# Altium schematic sheet uC.SchDoc
size OrCAD B; SheetNumber: 4; SheetTotal: 15
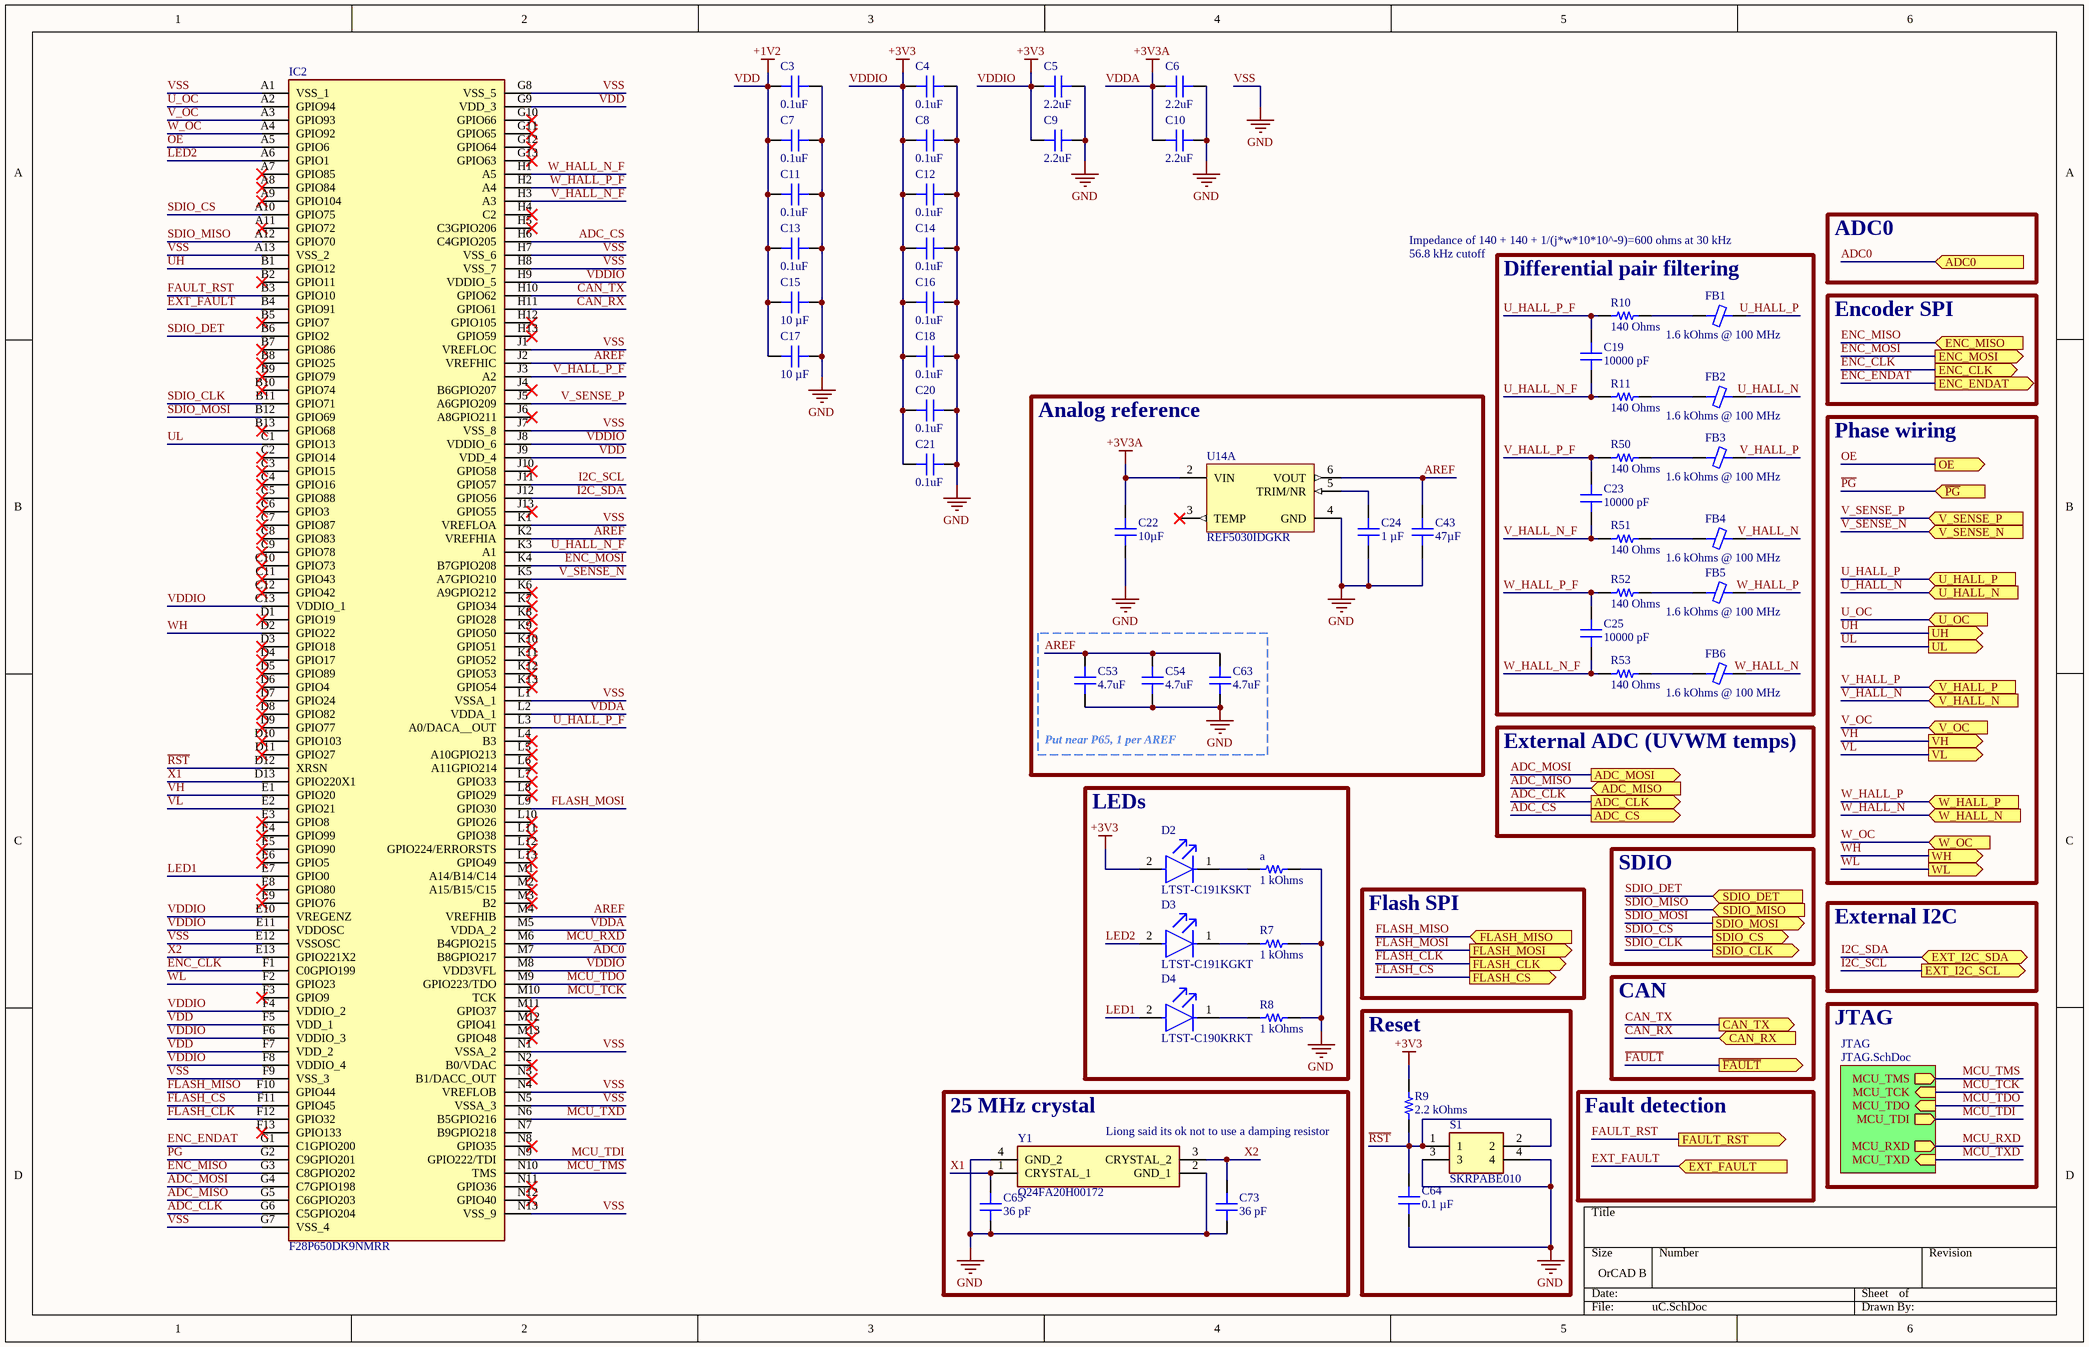
[diagram p0: uC.SchDoc]

## Parts
a  1 kOhms  [YAGEO RES 0402_1005]
C3  0.1uF  [0µF 0201-Footprint-1]
C4  0.1uF  [0µF 0201-Footprint-1]
C5  2.2uF  [0µF 0201-Footprint-1]
C6  2.2uF  [0µF 0201-Footprint-1]
C7  0.1uF  [0µF 0201-Footprint-1]
C8  0.1uF  [0µF 0201-Footprint-1]
C9  2.2uF  [0µF 0201-Footprint-1]
C10  2.2uF  [0µF 0201-Footprint-1]
C11  0.1uF  [0µF 0201-Footprint-1]
C12  0.1uF  [0µF 0201-Footprint-1]
C13  0.1uF  [0µF 0201-Footprint-1]
C14  0.1uF  [0µF 0201-Footprint-1]
C15  10 µF  [CAP 0402_1005]
C16  0.1uF  [0µF 0201-Footprint-1]
C17  10 µF  [CAP 0402_1005]
C18  0.1uF  [0µF 0201-Footprint-1]
C19  10000 pF  [CAP 0402_1005]
C20  0.1uF  [0µF 0201-Footprint-1]
C21  0.1uF  [0µF 0201-Footprint-1]
C22  10µF  [CAP 0402_1005]
C23  10000 pF  [CAP 0402_1005]
C24  1 µF  [CAP 0402_1005]
C25  10000 pF  [CAP 0402_1005]
C43  47µF  [CAP 0603_1608]
C53  4.7uF  [0µF 0201-Footprint-1]
C54  4.7uF  [0µF 0201-Footprint-1]
C63  4.7uF  [0µF 0201-Footprint-1]
C64  0.1 µF  [CAP 0402_1005]
C65  36 pF  [CAP 0402_1005]
C73  36 pF  [CAP 0402_1005]
D2  LTST-C191KSKT  [FP-LTST-C191KSKT-MFG]
D3  LTST-C191KGKT  [FP-LTST-C191KGKT-MFG]
D4  LTST-C190KRKT  [FP-LTST-C190KRKT-MFG]
FB1  1.6 kOhms @ 100 MHz  [FER 0603_1608]
FB2  1.6 kOhms @ 100 MHz  [FER 0603_1608]
FB3  1.6 kOhms @ 100 MHz  [FER 0603_1608]
FB4  1.6 kOhms @ 100 MHz  [FER 0603_1608]
FB5  1.6 kOhms @ 100 MHz  [FER 0603_1608]
FB6  1.6 kOhms @ 100 MHz  [FER 0603_1608]
IC2  F28P650DK9NMRR  [BGA169C65P13X13_900X900X100]
R7  1 kOhms  [YAGEO RES 0402_1005]
R8  1 kOhms  [YAGEO RES 0402_1005]
R9  2.2 kOhms  [RES 0402_1005]
R10  140 Ohms  [RES 0402_1005]
R11  140 Ohms  [RES 0402_1005]
R50  140 Ohms  [RES 0402_1005]
R51  140 Ohms  [RES 0402_1005]
R52  140 Ohms  [RES 0402_1005]
R53  140 Ohms  [RES 0402_1005]
S1  SKRPABE010  [SKRPABE010]
U14  REF5030IDGKR  [DGK0008A_L]  (part A of 2)
Y1  Q24FA20H00172  [FA20H160000MF12ZAC3]

## Blocks framed on the sheet
Differential pair filtering: C19 C23 C25 FB1-FB6 R10 R11 R50-R53
Analog reference: C22 C24 C43 U14
Put near P65, 1 per AREF: C53 C54 C63
LEDs: a D2-D4 R7 R8
Reset: C64 R9 S1
25 MHz crystal: C65 C73 Y1

## Sub-sheets
JTAG = JTAG.SchDoc: MCU_TMS (out), MCU_TCK (in), MCU_TDO (in), MCU_TDI (out), MCU_RXD (out), MCU_TXD (in)

## Ports
ADC0 (in), ADC_CLK (out), ADC_CS (out), ADC_MISO (in), ADC_MOSI (out), CAN_RX (in), CAN_TX (out), ENC_CLK (out), ENC_ENDAT (out), ENC_MISO (in), ENC_MOSI (out), EXT_FAULT (in), EXT_I2C_SCL (out), EXT_I2C_SDA (bidir), FAULT_RST (out), FLASH_CLK (out), FLASH_CS (out), FLASH_MISO (in), FLASH_MOSI (out), OE (out), SDIO_CLK (out), SDIO_CS (out), SDIO_DET (in), SDIO_MISO (in), SDIO_MOSI (out), U_HALL_N (in), U_HALL_P (in), U_OC (in), UH (out), UL (out), V_HALL_N (in), V_HALL_P (in), V_OC (in), V_SENSE_N (in), V_SENSE_P (in), VH (out), VL (out), W_HALL_N (in), W_HALL_P (in), W_OC (in), WH (out), WL (out), ~{FAULT} (out), ~{PG} (in)

## Nets
VDD: C3.1 C7.1 C11.1 C13.1 C15.1 C17.1 IC2.F5(VDD_1) IC2.F7(VDD_2) IC2.G9(VDD_3) IC2.J9(VDD_4)  [also labelled +1V2]
VDDA: C6.1 C10.1 C22.2 IC2.L2(VDDA_1) IC2.M5(VDDA_2) U14.2(VIN)  [also labelled +3V3A]
VDDIO: C4.1 C5.1 C8.1 C9.1 C12.1 C14.1 C16.1 C18.1 C20.1 C21.1 D2.2(A) IC2.C13(VDDIO_1) IC2.E10(VREGENZ) IC2.E11(VDDOSC) IC2.F4(VDDIO_2) IC2.F6(VDDIO_3) IC2.F8(VDDIO_4) IC2.H9(VDDIO_5) IC2.J8(VDDIO_6) IC2.M8(VDD3VFL) R9.2  [also labelled +3V3]
VSS: a.2 C3.2 C4.2 C5.2 C6.2 C7.2 C8.2 C9.2 C10.2 C11.2 C12.2 C13.2 C14.2 C15.2 C16.2 C17.2 C18.2 C20.2 C21.2 C22.1 C24.1 C43.1 C53.1 C54.1 C63.1 C64.1 C65.1 C73.1 IC2.A1(VSS_1) IC2.A13(VSS_2) IC2.E12(VSSOSC) IC2.F9(VSS_3) IC2.G7(VSS_4) IC2.G8(VSS_5) IC2.H7(VSS_6) IC2.H8(VSS_7) IC2.J1(VREFLOC) IC2.J7(VSS_8) IC2.K1(VREFLOA) IC2.L1(VSSA_1) IC2.N1(VSSA_2) IC2.N4(VREFLOB) IC2.N5(VSSA_3) IC2.N13(VSS_9) R7.2 R8.2 S1.3 S1.4 U14.4(GND) Y1.2(GND_1) Y1.4(GND_2)  [also labelled GND]
ADC0: IC2.M7(B8GPIO217) ; port ADC0
ADC_CLK: IC2.G6(C5GPIO204) ; port ADC_CLK
ADC_CS: IC2.H6(C4GPIO205) ; port ADC_CS
ADC_MISO: IC2.G5(C6GPIO203) ; port ADC_MISO
ADC_MOSI: IC2.G4(C7GPIO198) ; port ADC_MOSI
AREF: C43.2 C53.2 C54.2 C63.2 IC2.J2(VREFHIC) IC2.K2(VREFHIA) IC2.M4(VREFHIB) U14.6(VOUT)
CAN_RX: IC2.H11(GPIO61) ; port CAN_RX
CAN_TX: IC2.H10(GPIO62) ; port CAN_TX
ENC_CLK: IC2.F1(C0GPIO199) ; port ENC_CLK
ENC_ENDAT: IC2.G1(C1GPIO200) ; port ENC_ENDAT
ENC_MISO: IC2.G3(C8GPIO202) ; port ENC_MISO
ENC_MOSI: IC2.K4(B7GPIO208) ; port ENC_MOSI
EXT_FAULT: IC2.B4(GPIO91) ; port EXT_FAULT
~{FAULT}: port ~{FAULT}
FAULT_RST: IC2.B3(GPIO10) ; port FAULT_RST
FLASH_CLK: IC2.F12(GPIO32) ; port FLASH_CLK
FLASH_CS: IC2.F11(GPIO45) ; port FLASH_CS
FLASH_MISO: IC2.F10(GPIO44) ; port FLASH_MISO
FLASH_MOSI: IC2.L9(GPIO30) ; port FLASH_MOSI
I2C_SCL: IC2.J11(GPIO57) ; port EXT_I2C_SCL
I2C_SDA: IC2.J12(GPIO56) ; port EXT_I2C_SDA
LED1: D4.2(A) IC2.E7(GPIO0)
LED2: D3.2(A) IC2.A6(GPIO1)
MCU_RXD: IC2.M6(B4GPIO215) ; sheet JTAG/MCU_RXD
MCU_TCK: IC2.M10(TCK) ; sheet JTAG/MCU_TCK
MCU_TDI: IC2.N9(GPIO222/TDI) ; sheet JTAG/MCU_TDI
MCU_TDO: IC2.M9(GPIO223/TDO) ; sheet JTAG/MCU_TDO
MCU_TMS: IC2.N10(TMS) ; sheet JTAG/MCU_TMS
MCU_TXD: IC2.N6(B5GPIO216) ; sheet JTAG/MCU_TXD
OE: IC2.A5(GPIO6) ; port OE
~{PG}: IC2.G2(C9GPIO201) ; port ~{PG}
~{RST}: C64.2 IC2.D12(XRSN) R9.1 S1.1 S1.2
SDIO_CLK: IC2.B11(GPIO71) ; port SDIO_CLK
SDIO_CS: IC2.A10(GPIO75) ; port SDIO_CS
SDIO_DET: IC2.B6(GPIO2) ; port SDIO_DET
SDIO_MISO: IC2.A12(GPIO70) ; port SDIO_MISO
SDIO_MOSI: IC2.B12(GPIO69) ; port SDIO_MOSI
U_HALL_N: FB2.2 ; port U_HALL_N
U_HALL_N_F: C19.1 IC2.K3(A1) R11.1
U_HALL_P: FB1.2 ; port U_HALL_P
U_HALL_P_F: C19.2 IC2.L3(A0/DACA__OUT) R10.1
U_OC: IC2.A2(GPIO94) ; port U_OC
UH: IC2.B1(GPIO12) ; port UH
UL: IC2.C1(GPIO13) ; port UL
V_HALL_N: FB4.2 ; port V_HALL_N
V_HALL_N_F: C23.1 IC2.H3(A3) R51.1
V_HALL_P: FB3.2 ; port V_HALL_P
V_HALL_P_F: C23.2 IC2.J3(A2) R50.1
V_OC: IC2.A3(GPIO93) ; port V_OC
V_SENSE_N: IC2.K5(A7GPIO210) ; port V_SENSE_N
V_SENSE_P: IC2.J5(A6GPIO209) ; port V_SENSE_P
VH: IC2.E1(GPIO20) ; port VH
VL: IC2.E2(GPIO21) ; port VL
W_HALL_N: FB6.2 ; port W_HALL_N
W_HALL_N_F: C25.1 IC2.H1(A5) R53.1
W_HALL_P: FB5.2 ; port W_HALL_P
W_HALL_P_F: C25.2 IC2.H2(A4) R52.1
W_OC: IC2.A4(GPIO92) ; port W_OC
WH: IC2.D2(GPIO22) ; port WH
WL: IC2.F2(GPIO23) ; port WL
X1: C65.2 IC2.D13(GPIO220X1) Y1.1(CRYSTAL_1)
X2: C73.2 IC2.E13(GPIO221X2) Y1.3(CRYSTAL_2)
Neta_1: a.1 D2.1(C)
NetC24_2: C24.2 U14.5(TRIM/NR)
NetD3_1: D3.1(C) R7.1
NetD4_1: D4.1(C) R8.1
NetFB1_1: FB1.1 R10.2
NetFB2_1: FB2.1 R11.2
NetFB3_1: FB3.1 R50.2
NetFB4_1: FB4.1 R51.2
NetFB5_1: FB5.1 R52.2
NetFB6_1: FB6.1 R53.2

Not connected (* = marked no-connect by the designer): IC2 A7(GPIO85)* A8(GPIO84)* A9(GPIO104)* A11(GPIO72)* B2(GPIO11)* B5(GPIO7)* B7(GPIO86)* B8(GPIO25)* B9(GPIO79)* B10(GPIO74)* B13(GPIO68)* C2(GPIO14)* C3(GPIO15)* C4(GPIO16)* C5(GPIO88)* C6(GPIO3)* C7(GPIO87)* C8(GPIO83)* C9(GPIO78)* C10(GPIO73)* C11(GPIO43)* C12(GPIO42)* D1(GPIO19)* D3(GPIO18)* D4(GPIO17)* D5(GPIO89)* D6(GPIO4)* D7(GPIO24)* D8(GPIO82)* D9(GPIO77)* D10(GPIO103)* D11(GPIO27)* E3(GPIO8)* E4(GPIO99)* E5(GPIO90)* E6(GPIO5)* E8(GPIO80)* E9(GPIO76)* F3(GPIO9)* F13(GPIO133)* G10(GPIO66)* G11(GPIO65)* G12(GPIO64)* G13(GPIO63)* H4(C2)* H5(C3GPIO206)* H12(GPIO105)* H13(GPIO59)* J4(B6GPIO207)* J6(A8GPIO211)* J10(GPIO58)* J13(GPIO55)* K6(A9GPIO212)* K7(GPIO34)* K8(GPIO28)* K9(GPIO50)* K10(GPIO51)* K11(GPIO52)* K12(GPIO53)* K13(GPIO54)* L4(B3)* L5(A10GPIO213)* L6(A11GPIO214)* L7(GPIO33)* L8(GPIO29)* L10(GPIO26)* L11(GPIO38)* L12(GPIO224/ERRORSTS)* L13(GPIO49)* M1(A14/B14/C14)* M2(A15/B15/C15)* M3(B2)* M11(GPIO37)* M12(GPIO41)* M13(GPIO48)* N2(B0/VDAC)* N3(B1/DACC_OUT)* N7(B9GPIO218) N8(GPIO35)* N11(GPIO36)* N12(GPIO40)*; U14 3(TEMP)*

## Notes on the sheet
- 56.8 kHz cutoff
- Impedance of 140 + 140 + 1/(j*w*10*10^-9)=600 ohms at 30 kHz
- ADC0
- Encoder SPI
- Phase wiring
- External ADC (UVWM temps)
- SDIO
- Flash SPI
- External I2C
- CAN
- JTAG
- Liong said its ok not to use a damping resistor
- Fault detection

## Library data of the parts
a R7 R8 = RC0402JR-071KL: RES 1K OHM 5% 1/16W 0402; Manufacturer: Yageo; Power (Watts): 0.063W, 1/16W; Temperature Coefficient: ±100ppm/°C; Part Number: RC0402JR-071KL; Value: 1 kOhms; ComponentLink1Description: Datasheet; ComponentLink1URL: https://www.yageo.com/upload/media/product/productsearch/datasheet/rchip/PYu-RC_Group_51_RoHS_L_10.pdf; ComponentLink2Description: DigiKey Link; ComponentLink2URL: https://www.digikey.com/en/products/detail/yageo/RC0402JR-071KL/726408; Composition: Thick Film; Device Package: 0402 (1005 Metric); Features: Moisture Resistant; Height - Seated (Max): 0.016" (0.40mm); LastUpdated: 8/31/2025 3:03:59 PM; Lifecycle Status: Active; Minimum Order: 1; Number of Terminations: 2; Operating Temperature: -55°C ~ 155°C; Package / Case: 0402 (1005 Metric); Packaging: CutTape; PartId: 20532; Part Status: Active; Price: 0.01; Resistance: 1 kOhms; Series: RC_L; Size / Dimension: 0.039" L x 0.020" W (1.00mm x 0.50mm); Supplier 1: DigiKey; Supplier Part Number 1: 311-1.0KJRCT-ND; Supplier Device Package: 0402; Tolerance: ±5%
C3 C4 C7 C8 C11-C14 C16 C18 C20 C21 = CMP-714-000035-1: CAP CER 0.1UF 16V X5R 0201; ComponentLink2Description: DigiKey Link; ComponentLink1Description: Datasheet
C5 C6 C9 C10 = CMP-714-000035-1: CAP CER 2.2UF; ComponentLink2Description: DigiKey Link; ComponentLink1Description: Datasheet
C15 C17 = CL05A106MP8NUB8: CAP CER 10UF 10V X5R 0402; manufacturer: Samsung Electro-Mechanics; Tolerance: ±20%; Part Number: CL05A106MP8NUB8; Capacitance: 10 µF; Applications: Acoustic Noise Reduction; componentlink1description: Datasheet; componentlink1url: http://www.samsungsem.com/kr/support/product-search/mlcc/CL05A106MP8NUB8.jsp; componentlink2description: DigiKey Link; componentlink2url: https://www.digikey.com/en/products/detail/samsung-electro-mechanics/CL05A106MP8NUB8/5961314; Device Package: 0402 (1005 Metric); lastupdated: 2/9/2024 8:04:38 PM; Lifecycle Status: Active; Minimum Order: 1; Mounting Type: Surface Mount, MLCC; Operating Temperature: -55°C ~ 85°C; Package / Case: 0402 (1005 Metric); packaging: TapeAndReel; partid: 1758; Part Status: Active; price: 0.06; series: CL; Size / Dimension: 0.039" L x 0.020" W (1.00mm x 0.50mm); Supplier 1: DigiKey; Supplier Part Number 1: 1276-6830-1-ND; Temperature Coefficient: X5R; Thickness (Max): 0.035" (0.90mm); value: 10 µF; Voltage - Rated: 10V
C19 C23 C25 = C0402C103J5RECAUTO: CAP CER 0402 10NF 50V X7R 5%; manufacturer: KEMET; Part Number: C0402C103J5RECAUTO; Capacitance: 10000 pF; Applications: Automotive, ESD Protection; componentlink1description: Datasheet; componentlink1url: https://api.kemet.com/component-edge/download/datasheet/C0402C103J5RECAUTO.pdf; componentlink2description: DigiKey Link; componentlink2url: https://www.digikey.com/en/products/detail/kemet/C0402C103J5RECAUTO/8646448; Device Package: 0402 (1005 Metric); lastupdated: 2/9/2024 8:04:13 PM; Lifecycle Status: Active; Minimum Order: 1; Mounting Type: Surface Mount, MLCC; Operating Temperature: -55°C ~ 125°C; Package / Case: 0402 (1005 Metric); packaging: TapeAndReel; partid: 33153; Part Status: Active; price: 0.02; Ratings: AEC-Q200; series: ESD SMD Auto X7R; Size / Dimension: 0.039" L x 0.020" W (1.00mm x 0.50mm); Supplier 1: DigiKey; Supplier Part Number 1: 399-C0402C103J5RECAUTOCT-ND; Temperature Coefficient: X7R; Thickness (Max): 0.022" (0.55mm); Tolerance: ±5%; value: 10000 pF; Voltage - Rated: 50V
C22 = 0402ZD106MAT2A: CAP CER 10UF 10V X5R 0402; manufacturer: AVX Corporation; Tolerance: ±20%; Part Number: 0402ZD106MAT2A; Capacitance: 10µF; Applications: General Purpose; componentlink1description: Datasheet; componentlink1url: http://datasheets.avx.com/cx5r.pdf; componentlink2description: DigiKey Link; componentlink2url: http://digikey.com/product-detail/en/avx-corporation/0402ZD106MAT2A/478-10052-1-ND/6564275; Device Package: 0402 (1005 Metric); lastupdated: 2/8/2022 12:26:50 PM; Lifecycle Status: Active; Minimum Order: 1; Mounting Type: Surface Mount, MLCC; Operating Temperature: -55°C ~ 85°C; Package / Case: 0402 (1005 Metric); packaging: TapeAndReel; partid: 6854; Part Status: Active; price: 0.24; series: -; Size / Dimension: 0.039" L x 0.020" W (1.00mm x 0.50mm); Supplier 1: DigiKey; Supplier Part Number 1: 478-10052-1-ND; Temperature Coefficient: X5R; Thickness (Max): 0.028" (0.71mm); value: 10µF; Voltage - Rated: 10V
C24 = 0402BW105K160NGT: CAP CER 1UF 16V X5R 0402; manufacturer: Knowles Novacap; Tolerance: ±10%; Part Number: 0402BW105K160NGT; Capacitance: 1 µF; Applications: General Purpose; componentlink1description: Datasheet; componentlink1url: https://www.knowlescapacitors.com/getattachment/6c8d48ef-fc2b-4752-ae2c-ce6c208de0c4/High-Capacitance-Chip.aspx; componentlink2description: DigiKey Link; componentlink2url: https://www.digikey.com/en/products/detail/knowles-novacap/0402BW105K160NGT/7304075; Device Package: 0402 (1005 Metric); Features: Gold Flash Termination; lastupdated: 2/9/2024 8:04:33 PM; Lifecycle Status: Active; Minimum Order: 1; Mounting Type: Surface Mount, MLCC; Operating Temperature: -55°C ~ 85°C; Package / Case: 0402 (1005 Metric); packaging: TapeAndReel; partid: 4314; Part Status: Active; price: 1.00; series: -; Size / Dimension: 0.040" L x 0.020" W (1.02mm x 0.51mm); Supplier 1: DigiKey; Supplier Part Number 1: 1763-1163-1-ND; Temperature Coefficient: X5R; Thickness (Max): 0.024" (0.61mm); value: 1 µF; Voltage - Rated: 16V
C43 = 06036D476MAT2A: CAP CER 47UF 6.3V X5R 0603; manufacturer: AVX Corporation; Tolerance: ±20%; Part Number: 06036D476MAT2A; Capacitance: 47µF; Applications: General Purpose; componentlink1description: Datasheet; componentlink1url: http://datasheets.avx.com/cx5r.pdf; componentlink2description: DigiKey Link; componentlink2url: http://digikey.com/product-detail/en/avx-corporation/06036D476MAT2A/478-11180-1-ND/7563130; Device Package: 0603 (1608 Metric); lastupdated: 9/2/2020 1:03:20 AM; Lifecycle Status: Active; Minimum Order: 1; Mounting Type: Surface Mount, MLCC; Operating Temperature: -55°C ~ 85°C; Package / Case: 0603 (1608 Metric); packaging: TapeAndReel; partid: 11014; Part Status: Active; price: 0.41; series: -; Size / Dimension: 0.063" L x 0.031" W (1.60mm x 0.80mm); Supplier 1: DigiKey; Supplier Part Number 1: 478-11180-1-ND; Temperature Coefficient: X5R; value: 47µF; Voltage - Rated: 6.3V
C53 C54 C63 = CMP-714-000035-1: CAP CER 4.7UF; ComponentLink2Description: DigiKey Link; ComponentLink1Description: Datasheet
C64 = 0402B104J160CT: CAP CER 0.1UF 16V X7R 0402; manufacturer: Walsin Technology Corporation; Tolerance: ±5%; Part Number: 0402B104J160CT; Capacitance: 0.1 µF; Applications: General Purpose; componentlink1description: Datasheet; componentlink1url: http://www.passivecomponent.com/wp-content/uploads/2018/10/MLCC.pdf; componentlink2description: DigiKey Link; componentlink2url: https://www.digikey.com/en/products/detail/walsin-technology-corporation/0402B104J160CT/9354672; Device Package: 0402 (1005 Metric); lastupdated: 2/9/2024 8:04:31 PM; Lifecycle Status: Active; Minimum Order: 1; Mounting Type: Surface Mount, MLCC; Operating Temperature: -55°C ~ 125°C; Package / Case: 0402 (1005 Metric); packaging: TapeAndReel; partid: 41146; Part Status: Active; price: 0.01; series: -; Size / Dimension: 0.039" L x 0.020" W (1.00mm x 0.50mm); Supplier 1: DigiKey; Supplier Part Number 1: 1292-1174-1-ND; Temperature Coefficient: X7R; Thickness (Max): 0.022" (0.55mm); value: 0.1 µF; Voltage - Rated: 16V
C65 C73 = 0402N360J500CT: CAP CER 36PF 50V C0G/NP0 0402; manufacturer: Walsin Technology Corporation; Temperature Coefficient: C0G, NP0; Tolerance: ±5%; Part Number: 0402N360J500CT; Capacitance: 36 pF; Applications: General Purpose; componentlink1description: Datasheet; componentlink1url: http://www.passivecomponent.com/wp-content/uploads/2018/10/MLCC.pdf; componentlink2description: DigiKey Link; componentlink2url: https://www.digikey.com/en/products/detail/walsin-technology-corporation/0402N360J500CT/9354806; Device Package: 0402 (1005 Metric); lastupdated: 2/9/2024 8:04:27 PM; Lifecycle Status: Active; Minimum Order: 1; Mounting Type: Surface Mount, MLCC; Operating Temperature: -55°C ~ 125°C; Package / Case: 0402 (1005 Metric); packaging: TapeAndReel; partid: 8193; Part Status: Active; price: 0.01; series: -; Size / Dimension: 0.039" L x 0.020" W (1.00mm x 0.50mm); Supplier 1: DigiKey; Supplier Part Number 1: 1292-1309-1-ND; Thickness (Max): 0.022" (0.55mm); value: 36 pF; Voltage - Rated: 50V
D2 = CMP-22017-000025-1: LED YELLOW CLEAR SMD; Dominant Wavelength: 597nm; Power Rating: 75mW; Number of LEDs: 1; Lens Style: Diffused; Forward Current: 30mA; Test Current: 20mA; Forward Voltage: 2.4V; Wavelength: 588nm; Viewing Angle: 130°; Lens Color: Colorless; Reverse Voltage: 5V; Luminous Intensity: 180mcd; Case Code (Imperial): 0603; Width: 0.8mm; Power Dissipation: 75mW; Length: 1.6mm; Illumination Color: Yellow; Number of Pins: 2; Case Code (Metric): 1608; Mount: Surface Mount; Number of Elements: 1; Height: 0.55mm; Lens Transparency: Clear; Depth: 0.8mm; Min Operating Temperature: -55°C; Case/Package: 0603; Radiation Hardening: No; Max Operating Temperature: 85°C; Package Quantity: 1; Packaging: Tape and Reel; Lead Free: Lead Free; Color: Yellow
D3 = CMP-2000-05198-4: NexarPartId: 549907; Forward Voltage: 2V; Viewing Angle: 130°; Lens Transparency: Clear; Power Rating: 75mW; Number of LEDs: 1; Luminous Intensity: 35mcd; Forward Current: 20mA; Dominant Wavelength: 571nm; Illumination Color: Green; Lens Color: Clear, Colorless; Reverse Voltage: 5V; Wavelength: 574nm; Number of Pins: 2; Packaging: Tape and Reel; Number of Elements: 1; Schedule B: 8541402000, 8541402000; Height: 550µm; Case/Package: 0603; Depth: 800µm; Max Operating Temperature: 85°C; RoHS: Compliant; Lens Style: Clear; Lead Free: Lead Free; Length: 1.6mm; Mount: Surface Mount; Test Current: 20mA; Width: 800µm; Case Code (Imperial): 0603; Min Operating Temperature: -55°C; Case Code (Metric): 1608; Radiation Hardening: No; Power Dissipation: 75mW; Color: Green
D4 = CMP-1674-00011-2: LED RED CLEAR CHIP SMD; Reverse Voltage: 5V; Viewing Angle: 130°; Power Rating: 75mW; Test Current: 20mA; Number of Elements: 1; Lens Color: Colorless; Wavelength: 639nm; Dominant Wavelength: 631nm; Lens Style: Diffused; Forward Current: 30mA; Forward Voltage: 2.4V; Luminous Intensity: 54mcd; Color: Red; Case Code (Imperial): 0603; Lens Transparency: Clear; Lead Free: Lead Free; Package Quantity: 1; Packaging: Tape and Reel; Max Operating Temperature: 85°C; Number of Pins: 2; Height: 0.8mm; Case/Package: 0603; Number of LEDs: 1; Width: 0.8mm; Case Code (Metric): 1608; Depth: 0.8mm; Mount: Surface Mount; Radiation Hardening: No; Length: 1.6mm; Illumination Color: Red; Power Dissipation: 75mW; Min Operating Temperature: -55°C
FB1-FB6 = MHF1608BAC352ATD25: FERRITE BEAD 1.6K OHM 0603 1LN; Manufacturer: TDK Corporation; Current Rating (Max): 170mA; DC Resistance (DCR) (Max): 1.8Ohm; Number of Lines: 1; Part Number: MHF1608BAC352ATD25; ComponentLink1Description: Datasheet; ComponentLink1URL: https://media.digikey.com/pdf/Data%20Sheets/TDK%20PDFs/MHF1608_Type_DS.pdf; ComponentLink2Description: DigiKey Link; ComponentLink2URL: https://www.digikey.com/en/products/detail/tdk-corporation/MHF1608BAC352ATD25/12702586; Device Package: 0603 (1608 Metric); Height (Max): 0.037" (0.95mm); Impedance @ Frequency: 1.6 kOhms @ 100 MHz; LastUpdated: 6/3/2024 7:51:46 PM; Lifecycle Status: Active; Minimum Order: 1; Mounting Type: Surface Mount; Operating Temperature: -55°C ~ 125°C; Package / Case: 0603 (1608 Metric); Packaging: TapeAndReel; PartId: 2238; Part Status: Active; Price: 0.05; Ratings: AEC-Q200; Series: MHF; Size / Dimension: 0.063" L x 0.031" W (1.60mm x 0.80mm); Supplier 1: DigiKey; Supplier Part Number 1: 445-MHF1608BAC352ATD25CT-ND; Value: 1.6 kOhms @ 100 MHz
IC2 = F28P650DK9NMRR: Integrated Circuit; Manufacturer_Name: Texas Instruments; Datasheet Link: https://www.ti.com/lit/ds/symlink/tms320f28p650dk.pdf?ts=1743172224818&ref_url=https%253A%252F%252Fwww.ti.com%252Fproduct%252FTMS320F28P650DK%252Fpart-details%252FXF28P650DK9PTP; Height: 1mm; Manufacturer_Part_Number: F28P650DK9NMRR; Mouser Part Number: 595-F28P650DK9NMRR; Mouser Price/Stock: https://www.mouser.co.uk/ProductDetail/Texas-Instruments/F28P650DK9NMRR?qs=ZcfC38r4PouP1IzeuqZ7kg%3D%3D; Arrow Part Number: F28P650DK9NMRR; Arrow Price/Stock: https://www.arrow.com/en/products/f28p650dk9nmrr/texas-instruments?utm_currency=USD&region=nac
R9 = RR0510P-222-D: RES SMD 2.2K OHM 0.5% 1/16W 0402; Manufacturer: Susumu; Power (Watts): 0.063W, 1/16W; Temperature Coefficient: ±25ppm/°C; Part Number: RR0510P-222-D; Value: 2.2 kOhms; ComponentLink1Description: Datasheet; ComponentLink1URL: http://www.susumu.co.jp/common/pdf/n_catalog_partition05_en.pdf; ComponentLink2Description: DigiKey Link; ComponentLink2URL: https://www.digikey.com/en/products/detail/susumu/RR0510P-222-D/432405; Composition: Thin Film; Device Package: 0402 (1005 Metric); Height - Seated (Max): 0.016" (0.40mm); LastUpdated: 2/9/2024 8:30:21 PM; Lifecycle Status: Active; Minimum Order: 1; Number of Terminations: 2; Operating Temperature: -55°C ~ 125°C; Package / Case: 0402 (1005 Metric); Packaging: TapeAndReel; PartId: 3229; Part Status: Active; Price: 0.01; Resistance: 2.2 kOhms; Series: RR; Size / Dimension: 0.039" L x 0.020" W (1.00mm x 0.50mm); Supplier 1: DigiKey; Supplier Part Number 1: RR05P2.2KDCT-ND; Tolerance: ±0.5%
R10 R11 R50-R53 = RQ73C1E140RBTD: RES 140 OHMS 0.1% 1/16W 0402; Manufacturer: TE Connectivity Passive Product; Power (Watts): 0.063W, 1/16W; Temperature Coefficient: ±10ppm/°C; Part Number: RQ73C1E140RBTD; Value: 140 Ohms; ComponentLink1Description: Datasheet; ComponentLink1URL: //media.digikey.com/pdf/Data%20Sheets/Tyco%20Electronics%20P%20B%20PDFs/RQ73-0618%20v2.pdf; ComponentLink2Description: DigiKey Link; ComponentLink2URL: https://www.digikey.com/en/products/detail/te-connectivity-passive-product/RQ73C1E140RBTD/9480200; Composition: Thin Film; Device Package: 0402 (1005 Metric); Features: Anti-Sulfur, Automotive AEC-Q200; Height - Seated (Max): 0.016" (0.40mm); LastUpdated: 2/9/2024 8:30:21 PM; Lifecycle Status: Active; Minimum Order: 1; Number of Terminations: 2; Operating Temperature: -55°C ~ 155°C; Package / Case: 0402 (1005 Metric); Packaging: TapeAndReel; PartId: 3032; Part Status: Active; Price: 0.27; Ratings: AEC-Q200; Resistance: 140 Ohms; Series: RQ73; Size / Dimension: 0.039" L x 0.020" W (1.00mm x 0.50mm); Supplier 1: DigiKey; Supplier Part Number 1: A140252CT-ND; Supplier Device Package: 0402; Tolerance: ±0.1%
S1 = SKRPABE010: Switch; Manufacturer_Name: ALPS Electric; Datasheet Link: https://tech.alpsalpine.com/e/products/detail/SKRPABE010/; Height: 2.5mm; Manufacturer_Part_Number: SKRPABE010; Mouser Part Number: 688-SKRPAB; Mouser Price/Stock: https://www.mouser.co.uk/ProductDetail/Alps-Alpine/SKRPABE010?qs=m0BA540hBPe1GpcSf%2FZ5Yw%3D%3D
U14 = CMP-0367-00265-2: Low Noise, Very Low Drift, Precision Voltage Reference, -40 to 125 degC, 8-pin MSOP (DGK), Green (RoHS & no Sb/Br); Manufacturer: Texas Instruments; VI(Min)(V): 3.2; SubFamily: Series Voltage Reference; Rating: Catalog; Iout/Iz(Max)(mA): 10; Temp Coeff(Max)(ppm/ degree C): 3; Iq(Max)(uA): 1000; Initial Accuracy @ 25/deg C(%): 0.05; VI(Max)(V): 18; ComponentLink3URL: http://www.ti.com/litv/pdf/mpds028d; PackageVersion: 4073329/E; ComponentLink1URL: http://www.ti.com/; ComponentLink3Description: Package Specification; PackageReference: DGK0008A; Code_JEDEC: MO-187; ComponentLink1Description: Manufacturer URL; PackageDescription: 8-Pin Thin Small Outline Package 3 x 3 mm Body ,0.65 mm Pitch; ComponentLink2URL: http://www.ti.com/general/docs/lit/getliterature.tsp?genericPartNumber=REF5030&fileType=pdf; VO(V): 3; PartNumber: REF5030IDGKR; Eco-Plan: Green (RoHS & no Sb/Br); DatasheetVersion: SBOS410E; Mounting Technology: Surface Mount; ComponentLink2Description: Datasheet
Y1 = FA-20H_25.0000MD30Y-C0: Crystal or Oscillator; Manufacturer_Name: Epson Timing; Manufacturer_Part_Number: FA-20H 25.0000MD30Y-C0; Datasheet Link: https://support.epson.biz/td/api/doc_check.php?dl=brief_FA-20H&lang=en; Height: 0.55mm; Mouser Part Number: 732-FA-20H25MD30Y-C0; Mouser Price/Stock: https://www.mouser.co.uk/ProductDetail/Epson-Timing/FA-20H-25.0000MD30Y-C0?qs=f9yNj16SXrILXPvNJZKsVQ%3D%3D; Arrow Part Number: FA-20H 25.0000MD30Y-C0; Arrow Price/Stock: https://www.arrow.com/en/products/fa-20h25.0000md30y-c0/epson-electronics-america